# EAGLE schematic Easy_RFPA_RevC (EAGLE 6.6.0)
AUTHOR: MDT; BOMREV: 01; FABREV: B
Assembly variants: IRF520N_20W, IRF630_200W

## Sheet 1 of 6: Push-pull power stage
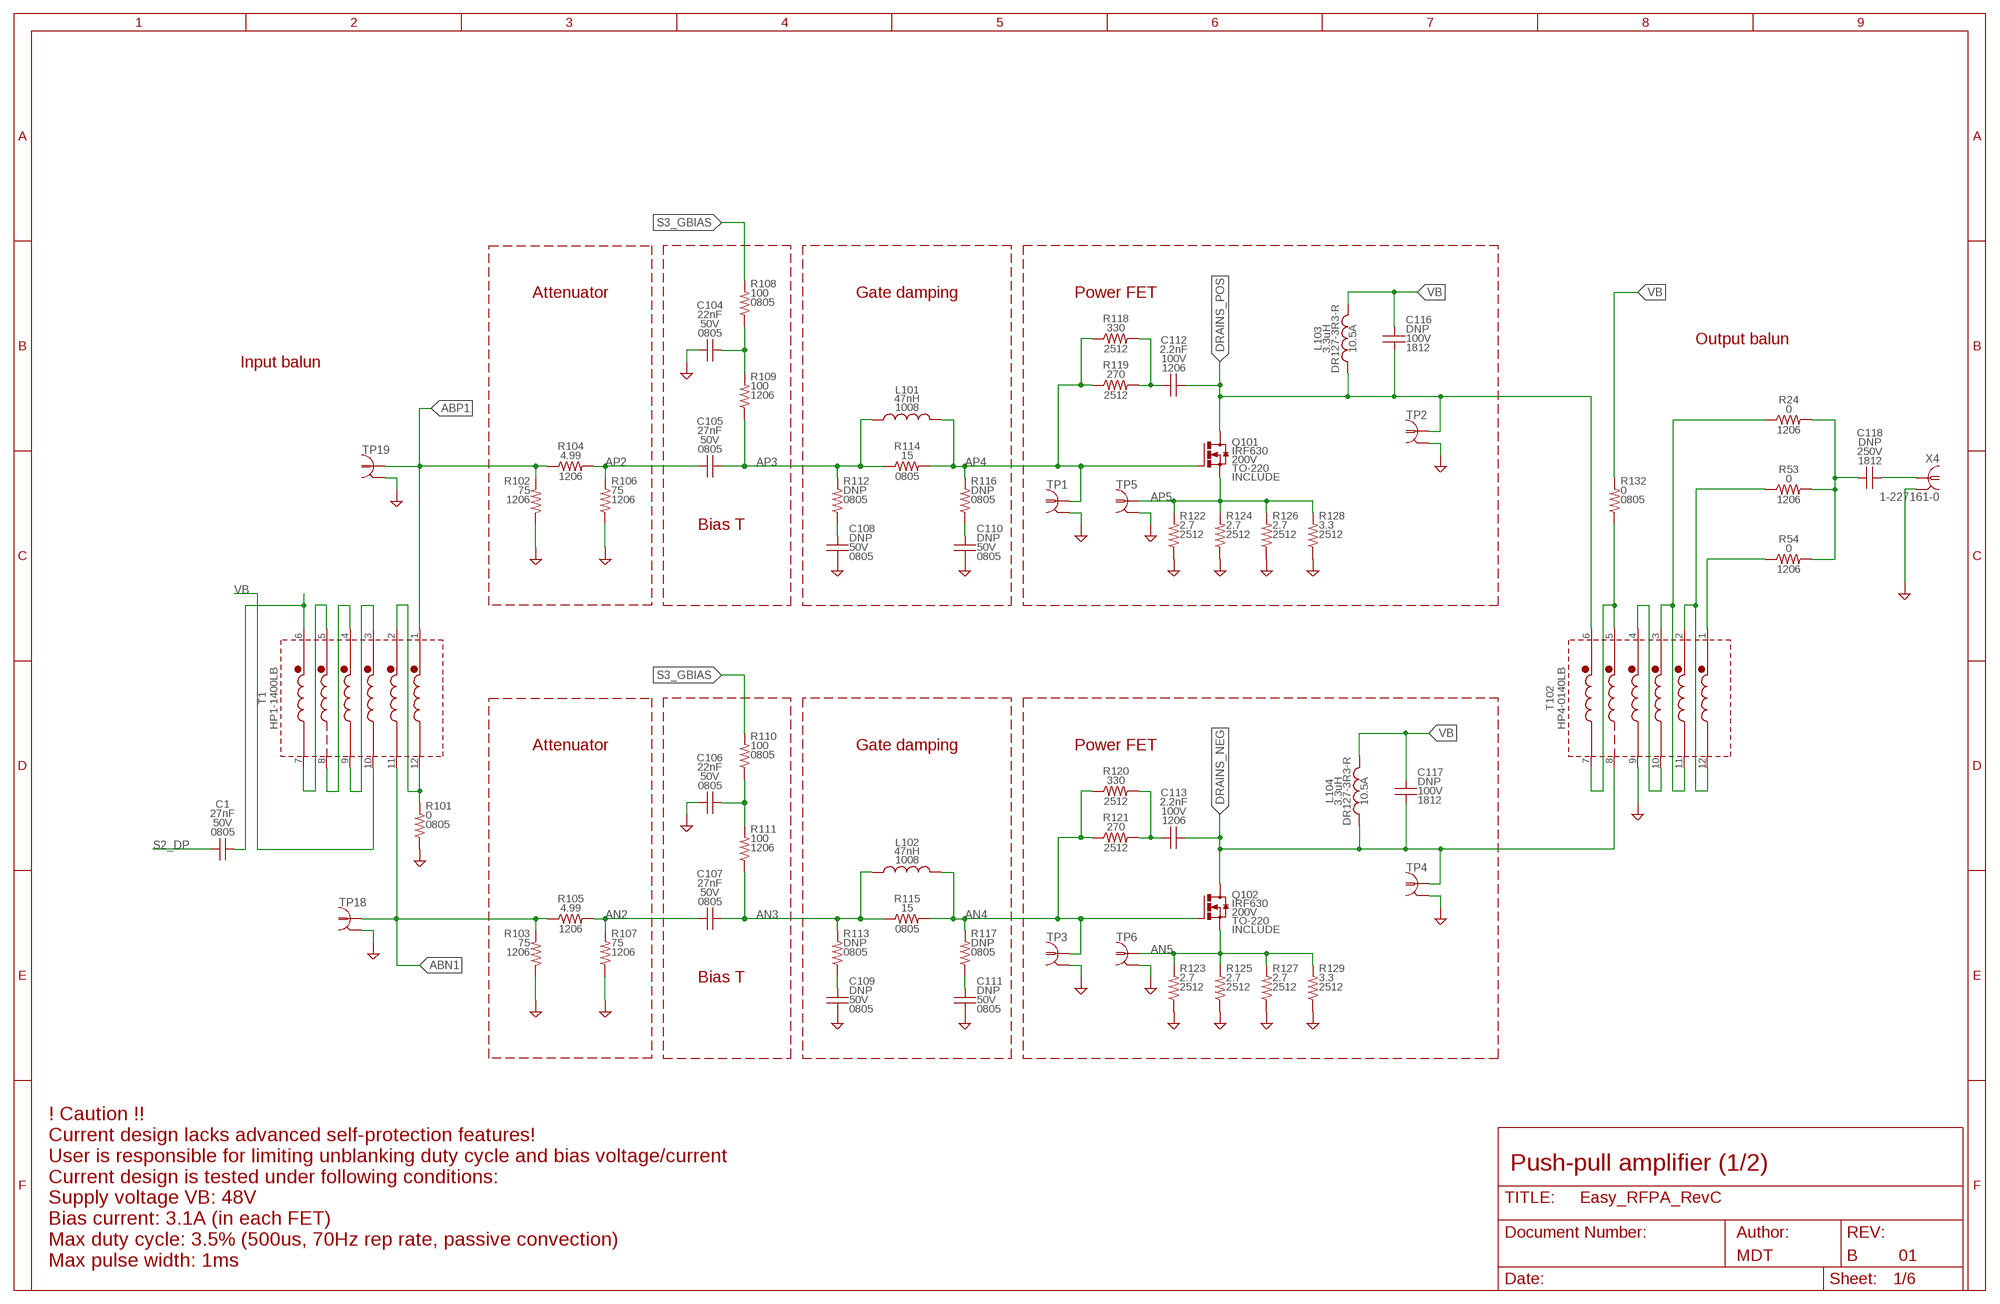
[diagram p0: schematic, sheet 1]

### Parts
C1  27nF  CGEN0805_IPC  [0805_IPC-7351B]
C104  22nF  CGEN0805_IPC  [0805_IPC-7351B]
C105  27nF  CGEN0805_IPC  [0805_IPC-7351B]
C106  22nF  CGEN0805_IPC  [0805_IPC-7351B]
C107  27nF  CGEN0805_IPC  [0805_IPC-7351B]
C108  DNP  CGEN0805_IPC  [0805_IPC-7351B]  (not fitted in variant IRF520N_20W)  (not fitted in variant IRF630_200W)
C109  DNP  CGEN0805_IPC  [0805_IPC-7351B]  (not fitted in variant IRF520N_20W)  (not fitted in variant IRF630_200W)
C110  DNP  CGEN0805_IPC  [0805_IPC-7351B]  (not fitted in variant IRF520N_20W)  (not fitted in variant IRF630_200W)
C111  DNP  CGEN0805_IPC  [0805_IPC-7351B]  (not fitted in variant IRF520N_20W)  (not fitted in variant IRF630_200W)
C112  2.2nF  CGENC1206  [C1206]
C113  2.2nF  CGENC1206  [C1206]
C116  DNP  CGENC1812  [C1812]
C117  DNP  CGENC1812  [C1812]
C118  DNP  CGENC1812  [C1812]  (not fitted in variant IRF630_200W)
L101  47nH  L_CHIPL-47N-AIR-5%-1008-1A1008  [L1008]
L102  47nH  L_CHIPL-47N-AIR-5%-1008-1A1008  [L1008]
L103  3.3uH  LL-3.3U-FERRITE-20%-12.5X12.5MM-10.5A  [DR127]  (variant IRF520N_20W: 22uH)
L104  3.3uH  LL-3.3U-FERRITE-20%-12.5X12.5MM-10.5A  [DR127]  (variant IRF520N_20W: 22uH)
Q101  IRF520N  MOSFET_NIRF630TO-220-VERT  [TO220BV]
Q102  IRF630  MOSFET_NIRF630TO-220-VERT  [TO220BV]
R24  0  R90GEN1206_IPC  [1206_IPC-7351B]
R53  0  R90GEN1206_IPC  [1206_IPC-7351B]
R54  0  R90GEN1206_IPC  [1206_IPC-7351B]
R101  0  RGEN0805_IPC  [0805_IPC-7351B]
R102  75  RGEN1206_IPC  [1206_IPC-7351B]
R103  75  RGEN1206_IPC  [1206_IPC-7351B]
R104  4.99  R90GEN1206_IPC  [1206_IPC-7351B]
R105  4.99  R90GEN1206_IPC  [1206_IPC-7351B]
R106  75  RGEN1206_IPC  [1206_IPC-7351B]
R107  75  RGEN1206_IPC  [1206_IPC-7351B]
R108  100  RGEN0805_IPC  [0805_IPC-7351B]
R109  100  RGEN1206_IPC  [1206_IPC-7351B]
R110  100  RGEN0805_IPC  [0805_IPC-7351B]
R111  100  RGEN1206_IPC  [1206_IPC-7351B]
R112  DNP  RGEN0805_IPC  [0805_IPC-7351B]  (not fitted in variant IRF520N_20W)  (not fitted in variant IRF630_200W)
R113  DNP  RGEN0805_IPC  [0805_IPC-7351B]  (not fitted in variant IRF520N_20W)  (not fitted in variant IRF630_200W)
R114  15  R90GEN0805_IPC  [0805_IPC-7351B]
R115  15  R90GEN0805_IPC  [0805_IPC-7351B]
R116  DNP  RGEN0805_IPC  [0805_IPC-7351B]  (not fitted in variant IRF520N_20W)  (not fitted in variant IRF630_200W)
R117  DNP  RGEN0805_IPC  [0805_IPC-7351B]  (not fitted in variant IRF520N_20W)  (not fitted in variant IRF630_200W)
R118  330  R90GENR2512  [R2512]
R119  270  R90GENR2512  [R2512]
R120  330  R90GENR2512  [R2512]
R121  270  R90GENR2512  [R2512]
R122  2.7  RGENR2512  [R2512]
R123  2.7  RGENR2512  [R2512]
R124  2.7  RGENR2512  [R2512]
R125  2.7  RGENR2512  [R2512]
R126  2.7  RGENR2512  [R2512]
R127  2.7  RGENR2512  [R2512]
R128  3.3  RGENR2512  [R2512]
R129  3.3  RGENR2512  [R2512]
R132  0  RGEN0805_IPC  [0805_IPC-7351B]
T1  HP1_TRAFO  [HP1]
T102  HP4_TRAFO  [HP4]
TP1  PROBE_TPTP_5MM  [PROBE_TP_5MM]
TP2  PROBE_TPTP_7P5MM  [PROBE_TP_7P5MM]
TP3  PROBE_TPTP_5MM  [PROBE_TP_5MM]
TP4  PROBE_TPTP_7P5MM  [PROBE_TP_7P5MM]
TP5  PROBE_TPTP_7P5MM  [PROBE_TP_7P5MM]
TP6  PROBE_TPTP_7P5MM  [PROBE_TP_7P5MM]
TP18  PROBE_TPTP_5MM  [PROBE_TP_5MM]
TP19  PROBE_TPTP_5MM  [PROBE_TP_5MM]
X4  1-227161-0  [AMP_227161]

### Nets
ABN1: R103.1 R105.1 T1.11(F2) TP18.TP ; also sheet 2
ABP1: R102.1 R104.1 T1.1(S1) TP19.TP ; also sheet 2
AN2: C107.2 R105.2 R107.1
AN3: C107.1 L102.1 R111.2 R113.1 R115.1
AN4: L102.2 Q102.G R115.2 R117.1 R120.1 R121.1 TP3.TP
AN5: Q102.S R123.1 R125.1 R127.1 R129.1 TP6.TP ; also sheet 3
AP2: C105.2 R104.2 R106.1
AP3: C105.1 L101.1 R109.2 R112.1 R114.1
AP4: L101.2 Q101.G R114.2 R116.1 R118.1 R119.1 TP1.TP
AP5: Q101.S R122.1 R124.1 R126.1 R128.1 TP5.TP ; also sheet 3
DRAINS_NEG [32W_20S]: C113.2 C117.2 L104.1 Q102.D T102.8(F5) TP4.TP ; also sheet 2
DRAINS_POS [32W_30S]: C112.2 C116.2 L103.1 Q101.D T102.6(S6) TP2.TP ; also sheet 2
GND: C104.2 C106.2 C108.2 C109.2 C110.2 C111.2 R101.2 R102.2 R103.2 R106.2 R107.2 R122.2 R123.2 R124.2 R125.2 R126.2 R127.2 R128.2 R129.2 T102.9(F4) TP1.GND(GND1) TP2.GND(GND1) TP3.GND(GND1) TP4.GND(GND1) TP5.GND(GND1) TP6.GND(GND1) TP18.GND(GND1) TP19.GND(GND1) X4.2 ; also sheet 2,3,4,5,6
N$4: C113.1 R120.2 R121.2
N$5: C109.1 R113.2
N$8: C104.1 R108.2 R109.1
N$10: C108.1 R112.2
N$11: C110.1 R116.2
N$12: C112.1 R118.2 R119.2
N$13: C106.1 R110.2 R111.1
N$17: C111.1 R117.2
N$29 [32W_30S]: R53.1 T102.2(S2) T102.12(F1)
N$30 [32W_30S]: R54.1 T102.1(S1)
N$31 [32W_30S]: C118.2 X4.1
N$49: C1.1 T1.6(S6)
N$52 [32W_30S]: R24.1 T102.3(S3) T102.11(F2)
N$58 [32W_30S]: T102.4(S4) T102.10(F3)
N$85: C118.1 R24.2 R53.2 R54.2
S2_DP: C1.2 ; also sheet 5
S3_GBIAS: R108.1 R110.1 ; also sheet 2,3
T1_CT: R101.1 T1.2(S2) T1.12(F1)
T1_P1: T1.5(S5) T1.7(F6)
T1_P2: T1.4(S4) T1.8(F5)
T1_P3: T1.3(S3) T1.9(F4)
VB: C116.1 C117.1 L103.2 L104.2 R132.1 T1.10(F3) ; also sheet 4,5
VB_CT: R132.2 T102.5(S5) T102.7(F6)

### Notes on the sheet
- Attenuator | Gate damping | Power FET
- Output balun
- Input balun
- Bias T
- Attenuator | Gate damping | Power FET
- Bias T
- Push-pull amplifier (1/2)
- ! Caution !!
  Current design lacks advanced self-protection features!
  User is responsible for limiting unblanking duty cycle and bias voltage/current
  Current design is tested under following conditions:
  Supply voltage VB: 48V
  Bias current: 3.1A (in each FET)
  Max duty cycle: 3.5% (500us, 70Hz rep rate, passive convection)
  Max pulse width: 1ms

## Sheet 2 of 6: Parallel copy of push-pull power stage
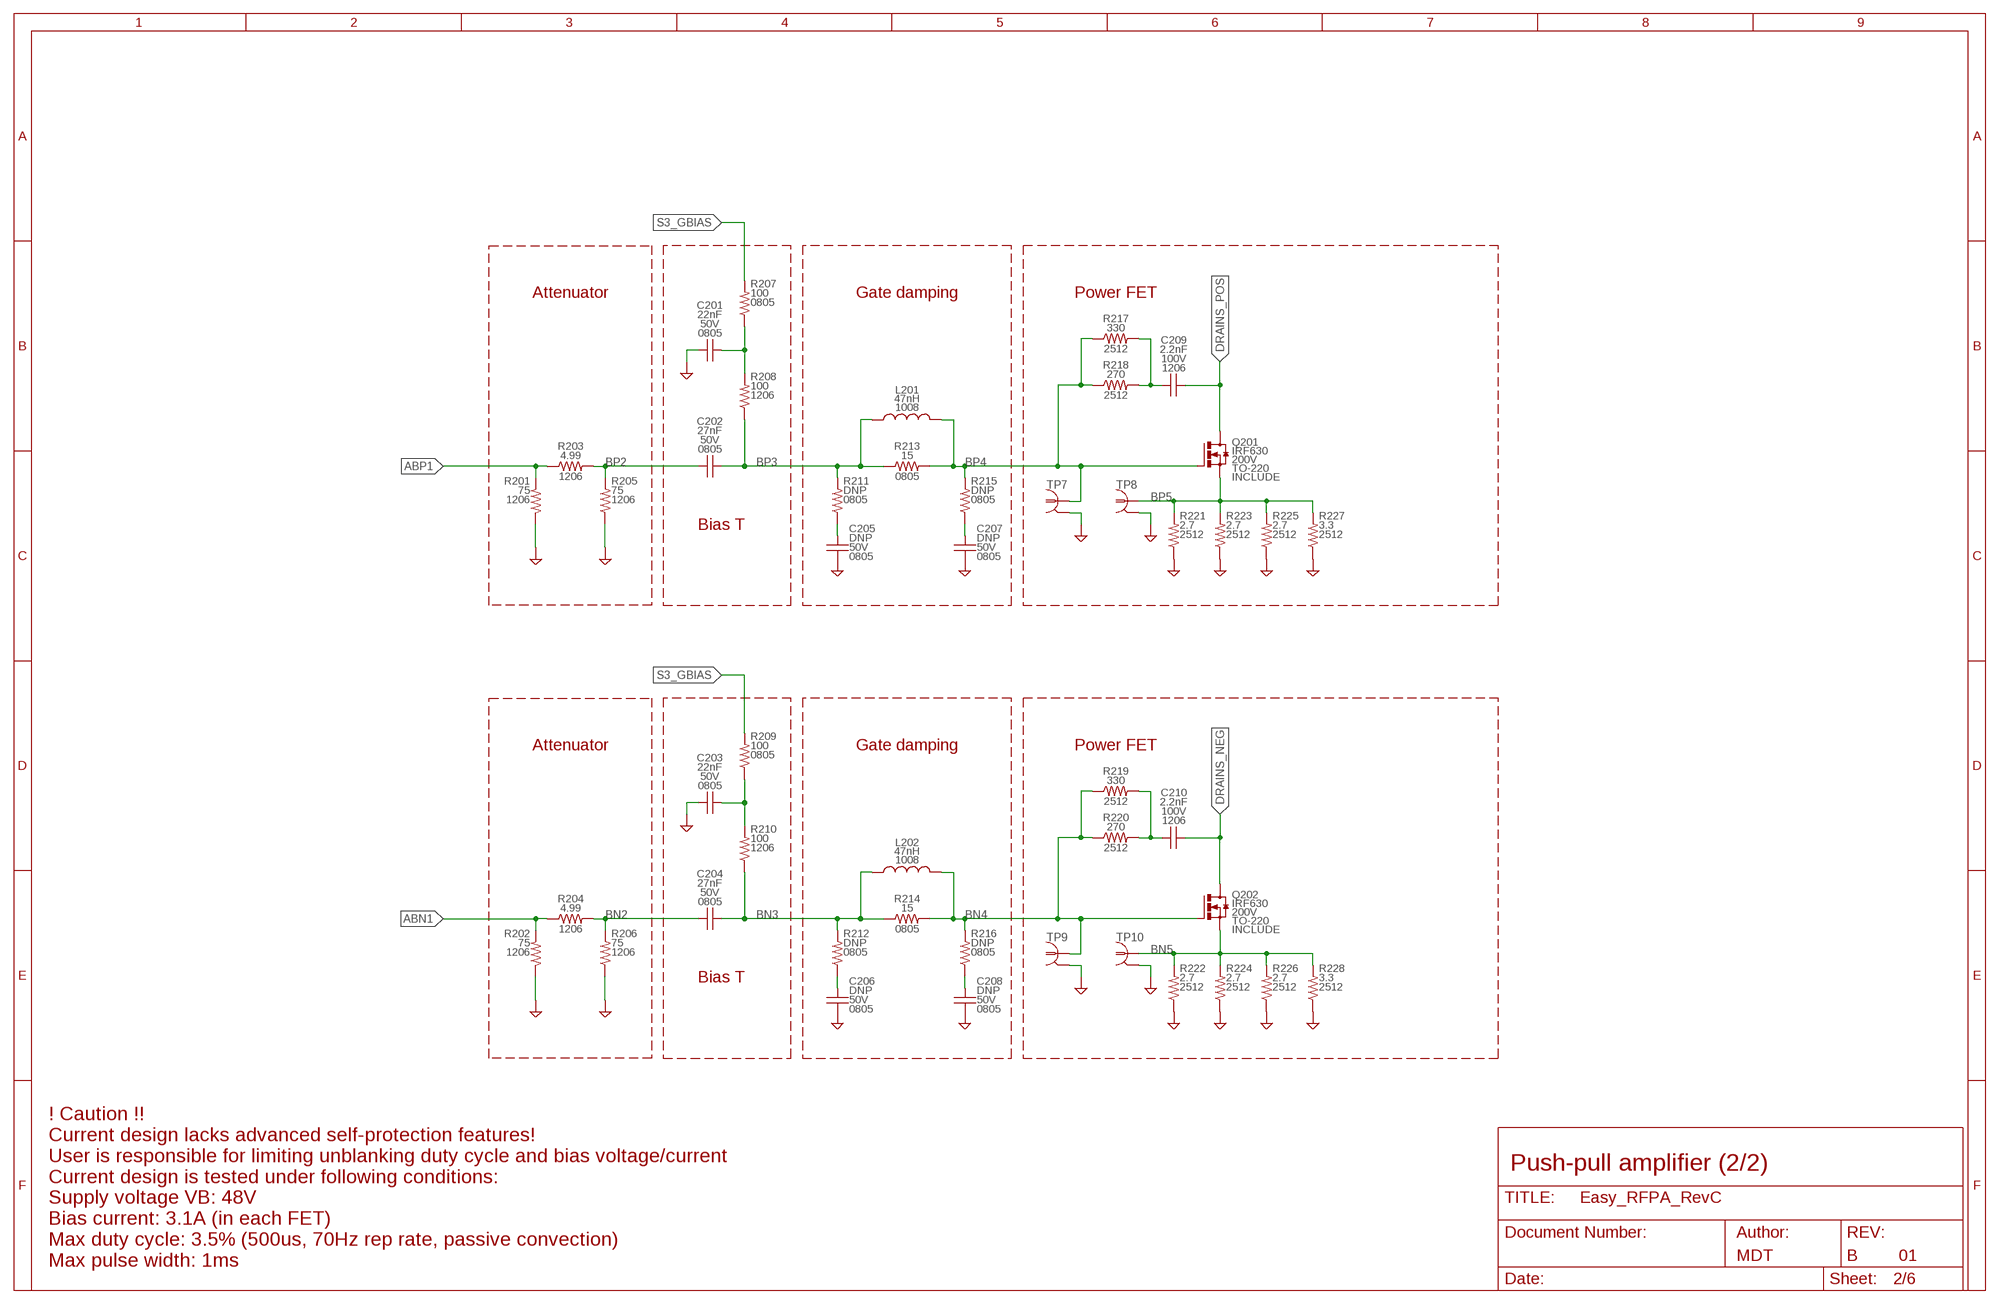
[diagram p1: schematic, sheet 2]

### Parts
C201  22nF  CGEN0805_IPC  [0805_IPC-7351B]  (not fitted in variant IRF520N_20W)
C202  27nF  CGEN0805_IPC  [0805_IPC-7351B]  (not fitted in variant IRF520N_20W)
C203  22nF  CGEN0805_IPC  [0805_IPC-7351B]  (not fitted in variant IRF520N_20W)
C204  27nF  CGEN0805_IPC  [0805_IPC-7351B]  (not fitted in variant IRF520N_20W)
C205  DNP  CGEN0805_IPC  [0805_IPC-7351B]  (not fitted in variant IRF520N_20W)  (not fitted in variant IRF630_200W)
C206  DNP  CGEN0805_IPC  [0805_IPC-7351B]  (not fitted in variant IRF520N_20W)  (not fitted in variant IRF630_200W)
C207  DNP  CGEN0805_IPC  [0805_IPC-7351B]  (not fitted in variant IRF520N_20W)  (not fitted in variant IRF630_200W)
C208  DNP  CGEN0805_IPC  [0805_IPC-7351B]  (not fitted in variant IRF520N_20W)  (not fitted in variant IRF630_200W)
C209  2.2nF  CGENC1206  [C1206]  (not fitted in variant IRF520N_20W)
C210  2.2nF  CGENC1206  [C1206]  (not fitted in variant IRF520N_20W)
L201  47nH  L_CHIPL-47N-AIR-5%-1008-1A1008  [L1008]  (not fitted in variant IRF520N_20W)
L202  47nH  L_CHIPL-47N-AIR-5%-1008-1A1008  [L1008]  (not fitted in variant IRF520N_20W)
Q201  IRF630  MOSFET_NIRF630TO-220-VERT  [TO220BV]  (not fitted in variant IRF520N_20W)
Q202  IRF630  MOSFET_NIRF630TO-220-VERT  [TO220BV]  (not fitted in variant IRF520N_20W)
R201  75  RGEN1206_IPC  [1206_IPC-7351B]  (not fitted in variant IRF520N_20W)
R202  75  RGEN1206_IPC  [1206_IPC-7351B]  (not fitted in variant IRF520N_20W)
R203  4.99  R90GEN1206_IPC  [1206_IPC-7351B]  (not fitted in variant IRF520N_20W)
R204  4.99  R90GEN1206_IPC  [1206_IPC-7351B]  (not fitted in variant IRF520N_20W)
R205  75  RGEN1206_IPC  [1206_IPC-7351B]  (not fitted in variant IRF520N_20W)
R206  75  RGEN1206_IPC  [1206_IPC-7351B]  (not fitted in variant IRF520N_20W)
R207  100  RGEN0805_IPC  [0805_IPC-7351B]  (not fitted in variant IRF520N_20W)
R208  100  RGEN1206_IPC  [1206_IPC-7351B]  (not fitted in variant IRF520N_20W)
R209  100  RGEN0805_IPC  [0805_IPC-7351B]  (not fitted in variant IRF520N_20W)
R210  100  RGEN1206_IPC  [1206_IPC-7351B]  (not fitted in variant IRF520N_20W)
R211  DNP  RGEN0805_IPC  [0805_IPC-7351B]  (not fitted in variant IRF520N_20W)  (not fitted in variant IRF630_200W)
R212  DNP  RGEN0805_IPC  [0805_IPC-7351B]  (not fitted in variant IRF520N_20W)  (not fitted in variant IRF630_200W)
R213  15  R90GEN0805_IPC  [0805_IPC-7351B]  (not fitted in variant IRF520N_20W)
R214  15  R90GEN0805_IPC  [0805_IPC-7351B]  (not fitted in variant IRF520N_20W)
R215  DNP  RGEN0805_IPC  [0805_IPC-7351B]  (not fitted in variant IRF520N_20W)  (not fitted in variant IRF630_200W)
R216  DNP  RGEN0805_IPC  [0805_IPC-7351B]  (not fitted in variant IRF520N_20W)  (not fitted in variant IRF630_200W)
R217  330  R90GENR2512  [R2512]  (not fitted in variant IRF520N_20W)
R218  270  R90GENR2512  [R2512]  (not fitted in variant IRF520N_20W)
R219  330  R90GENR2512  [R2512]  (not fitted in variant IRF520N_20W)
R220  270  R90GENR2512  [R2512]  (not fitted in variant IRF520N_20W)
R221  2.7  RGENR2512  [R2512]  (not fitted in variant IRF520N_20W)
R222  2.7  RGENR2512  [R2512]  (not fitted in variant IRF520N_20W)
R223  2.7  RGENR2512  [R2512]  (not fitted in variant IRF520N_20W)
R224  2.7  RGENR2512  [R2512]  (not fitted in variant IRF520N_20W)
R225  2.7  RGENR2512  [R2512]  (not fitted in variant IRF520N_20W)
R226  2.7  RGENR2512  [R2512]  (not fitted in variant IRF520N_20W)
R227  3.3  RGENR2512  [R2512]  (not fitted in variant IRF520N_20W)
R228  3.3  RGENR2512  [R2512]  (not fitted in variant IRF520N_20W)
TP7  PROBE_TPTP_5MM  [PROBE_TP_5MM]
TP8  PROBE_TPTP_7P5MM  [PROBE_TP_7P5MM]
TP9  PROBE_TPTP_5MM  [PROBE_TP_5MM]
TP10  PROBE_TPTP_7P5MM  [PROBE_TP_7P5MM]

### Nets
ABN1: R202.1 R204.1 ; also sheet 1
ABP1: R201.1 R203.1 ; also sheet 1
BN2: C204.2 R204.2 R206.1
BN3: C204.1 L202.1 R210.2 R212.1 R214.1
BN4: L202.2 Q202.G R214.2 R216.1 R219.1 R220.1 TP9.TP
BN5: Q202.S R222.1 R224.1 R226.1 R228.1 TP10.TP ; also sheet 3
BP2: C202.2 R203.2 R205.1
BP3: C202.1 L201.1 R208.2 R211.1 R213.1
BP4: L201.2 Q201.G R213.2 R215.1 R217.1 R218.1 TP7.TP
BP5: Q201.S R221.1 R223.1 R225.1 R227.1 TP8.TP ; also sheet 3
DRAINS_NEG [32W_20S]: C210.2 Q202.D ; also sheet 1
DRAINS_POS [32W_30S]: C209.2 Q201.D ; also sheet 1
GND: C201.2 C203.2 C205.2 C206.2 C207.2 C208.2 R201.2 R202.2 R205.2 R206.2 R221.2 R222.2 R223.2 R224.2 R225.2 R226.2 R227.2 R228.2 TP7.GND(GND1) TP8.GND(GND1) TP9.GND(GND1) TP10.GND(GND1) ; also sheet 1,3,4,5,6
N$35: C203.1 R209.2 R210.1
N$36: C206.1 R212.2
N$38: C208.1 R216.2
N$39: C210.1 R219.2 R220.2
N$40: C201.1 R207.2 R208.1
N$42: C205.1 R211.2
N$48: C207.1 R215.2
N$50: C209.1 R217.2 R218.2
S3_GBIAS: R207.1 R209.1 ; also sheet 1,3

### Notes on the sheet
- Attenuator | Gate damping | Power FET
- Bias T
- Attenuator | Gate damping | Power FET
- Bias T
- Push-pull amplifier (2/2)
- ! Caution !!
  Current design lacks advanced self-protection features!
  User is responsible for limiting unblanking duty cycle and bias voltage/current
  Current design is tested under following conditions:
  Supply voltage VB: 48V
  Bias current: 3.1A (in each FET)
  Max duty cycle: 3.5% (500us, 70Hz rep rate, passive convection)
  Max pulse width: 1ms

## Sheet 3 of 6: Gate bias driver
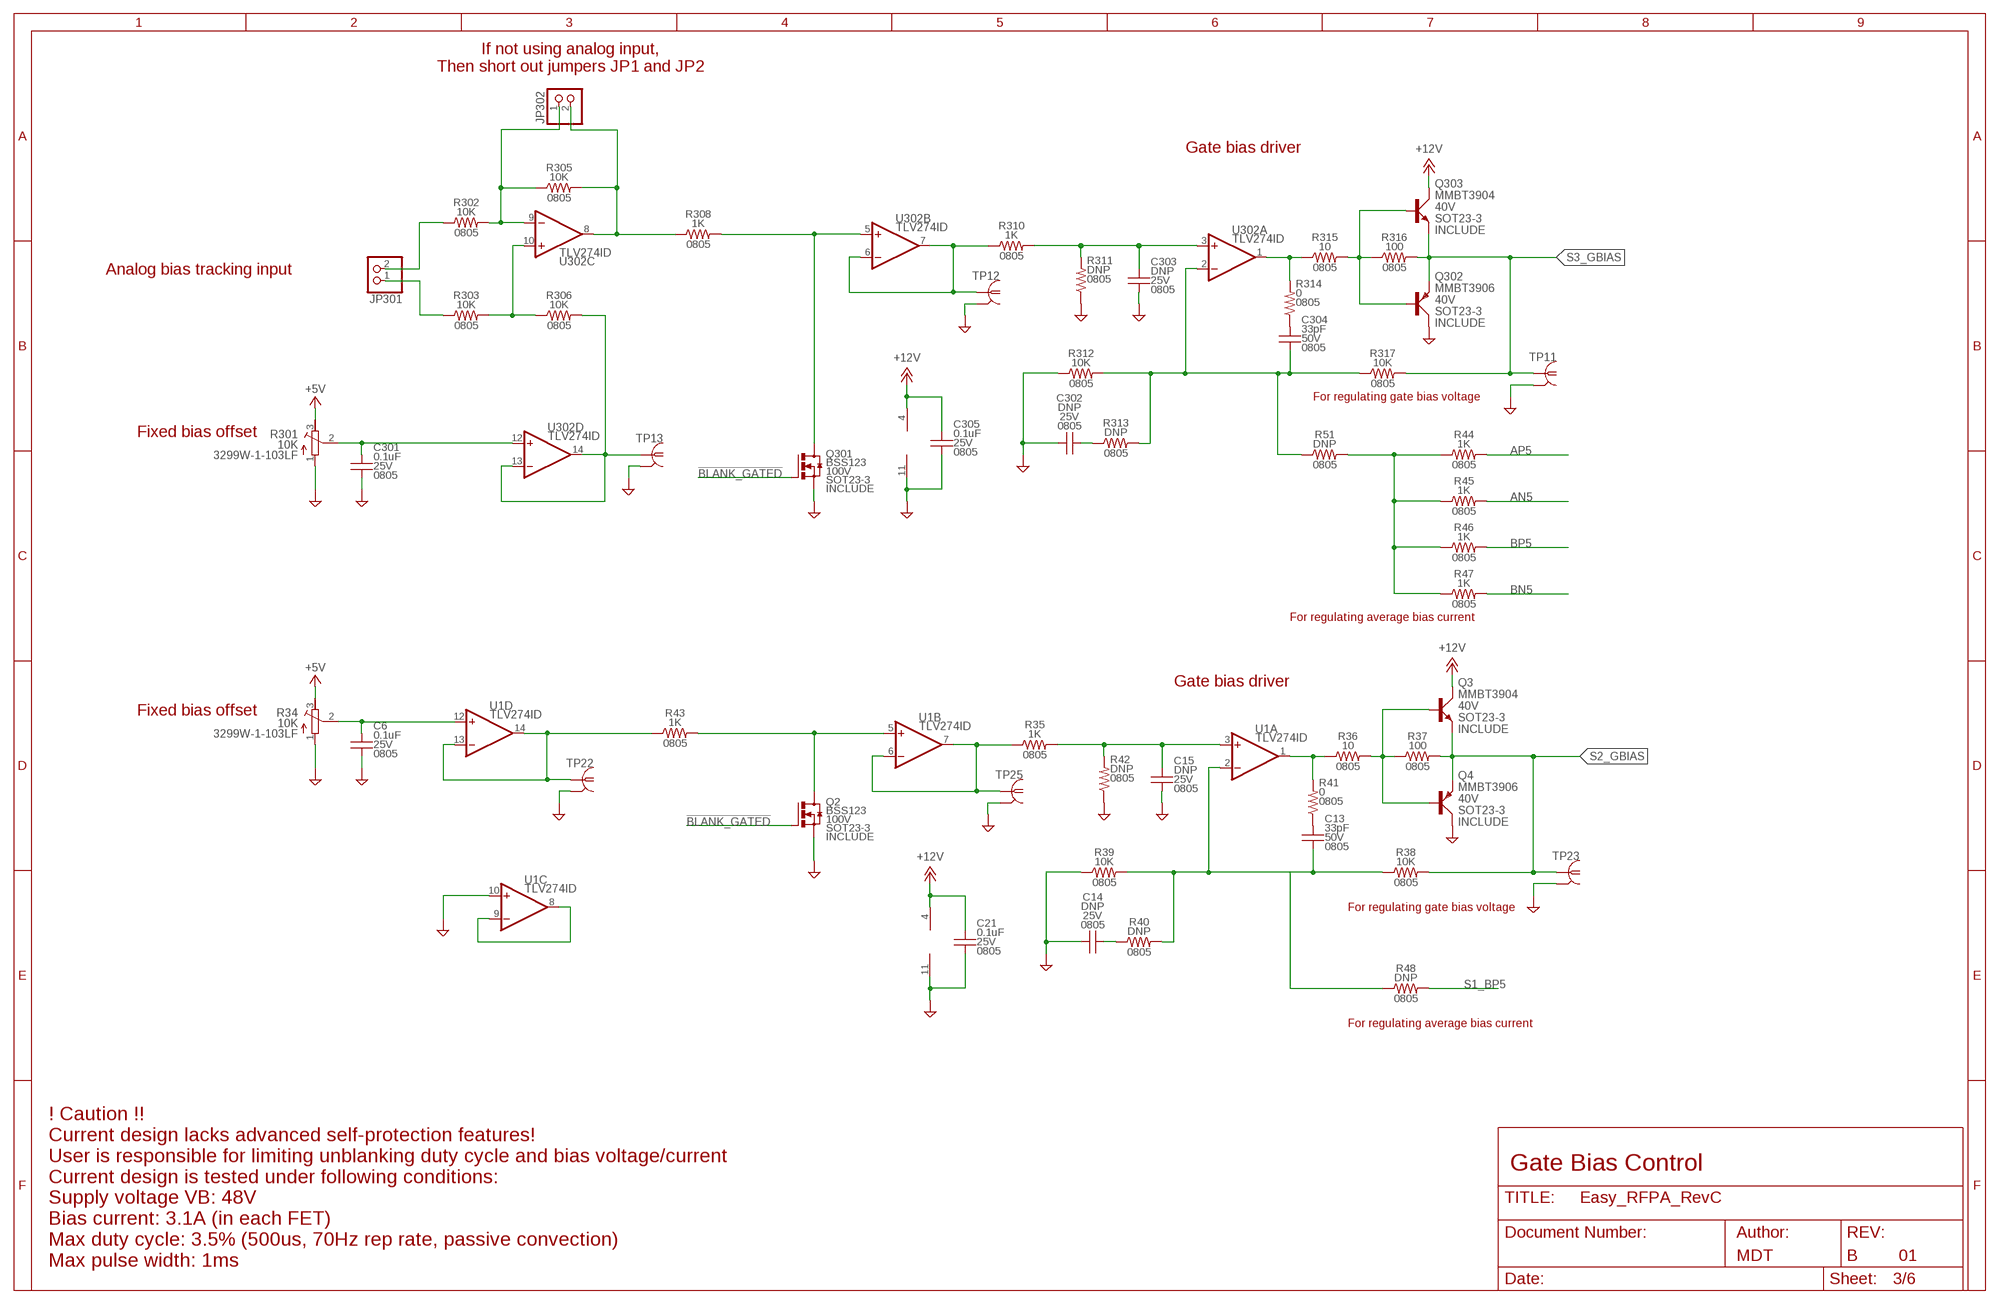
[diagram p2: schematic, sheet 3]

### Parts
C6  0.1uF  CGEN0805_IPC  [0805_IPC-7351B]
C13  33pF  CGEN0805_IPC  [0805_IPC-7351B]
C14  DNP  CGEN0805_IPC  [0805_IPC-7351B]  (not fitted in variant IRF520N_20W)  (not fitted in variant IRF630_200W)
C15  DNP  CGEN0805_IPC  [0805_IPC-7351B]  (not fitted in variant IRF520N_20W)  (not fitted in variant IRF630_200W)
C21  0.1uF  CGEN0805_IPC  [0805_IPC-7351B]
C301  0.1uF  CGEN0805_IPC  [0805_IPC-7351B]
C302  DNP  CGEN0805_IPC  [0805_IPC-7351B]  (not fitted in variant IRF520N_20W)  (not fitted in variant IRF630_200W)
C303  DNP  CGEN0805_IPC  [0805_IPC-7351B]  (not fitted in variant IRF520N_20W)  (not fitted in variant IRF630_200W)
C304  33pF  CGEN0805_IPC  [0805_IPC-7351B]
C305  0.1uF  CGEN0805_IPC  [0805_IPC-7351B]
JP301  PINHD-1X2  [1X02]
JP302  PINHD-1X2  [1X02]
Q2  MOSFET_NBSS123SOT23  [SOT23R_INFINEON]
Q3  NPNMMBT3904SOT23_BEC  [SOT23R_INFINEON]
Q4  PNPSOT23_BEC  [SOT23R_INFINEON]
Q301  MOSFET_NBSS123SOT23  [SOT23R_INFINEON]
Q302  PNPSOT23_BEC  [SOT23R_INFINEON]
Q303  NPNMMBT3904SOT23_BEC  [SOT23R_INFINEON]
R34  10K  RTRIMRTRIM-10K-10%-3299W-0.5W3299W  [RTRIM3299W]
R35  1K  R90GEN0805_IPC  [0805_IPC-7351B]
R36  10  R90GEN0805_IPC  [0805_IPC-7351B]
R37  100  R90GEN0805_IPC  [0805_IPC-7351B]
R38  10K  R90GEN0805_IPC  [0805_IPC-7351B]
R39  10K  R90GEN0805_IPC  [0805_IPC-7351B]
R40  DNP  R90GEN0805_IPC  [0805_IPC-7351B]  (not fitted in variant IRF520N_20W)  (not fitted in variant IRF630_200W)
R41  0  RGEN0805_IPC  [0805_IPC-7351B]
R42  DNP  RGEN0805_IPC  [0805_IPC-7351B]  (not fitted in variant IRF520N_20W)  (not fitted in variant IRF630_200W)
R43  1K  R90GEN0805_IPC  [0805_IPC-7351B]
R44  1K  R90GEN0805_IPC  [0805_IPC-7351B]
R45  1K  R90GEN0805_IPC  [0805_IPC-7351B]
R46  1K  R90GEN0805_IPC  [0805_IPC-7351B]
R47  1K  R90GEN0805_IPC  [0805_IPC-7351B]
R48  DNP  R90GEN0805_IPC  [0805_IPC-7351B]
R51  DNP  R90GEN0805_IPC  [0805_IPC-7351B]
R301  10K  RTRIMRTRIM-10K-10%-3299W-0.5W3299W  [RTRIM3299W]
R302  10K  R90GEN0805_IPC  [0805_IPC-7351B]
R303  10K  R90GEN0805_IPC  [0805_IPC-7351B]
R305  10K  R90GEN0805_IPC  [0805_IPC-7351B]
R306  10K  R90GEN0805_IPC  [0805_IPC-7351B]
R308  1K  R90GEN0805_IPC  [0805_IPC-7351B]
R310  1K  R90GEN0805_IPC  [0805_IPC-7351B]
R311  DNP  RGEN0805_IPC  [0805_IPC-7351B]  (not fitted in variant IRF520N_20W)  (not fitted in variant IRF630_200W)
R312  10K  R90GEN0805_IPC  [0805_IPC-7351B]
R313  DNP  R90GEN0805_IPC  [0805_IPC-7351B]  (not fitted in variant IRF520N_20W)  (not fitted in variant IRF630_200W)
R314  0  RGEN0805_IPC  [0805_IPC-7351B]
R315  10  R90GEN0805_IPC  [0805_IPC-7351B]
R316  100  R90GEN0805_IPC  [0805_IPC-7351B]
R317  10K  R90GEN0805_IPC  [0805_IPC-7351B]
TP11  PROBE_TPTP_5MM  [PROBE_TP_5MM]
TP12  PROBE_TPTP_5MM  [PROBE_TP_5MM]
TP13  PROBE_TPTP_5MM  [PROBE_TP_5MM]
TP22  PROBE_TPTP_5MM  [PROBE_TP_5MM]
TP23  PROBE_TPTP_5MM  [PROBE_TP_5MM]
TP25  PROBE_TPTP_5MM  [PROBE_TP_5MM]
U1  OPAMP_QUADTLV274IDSOIC14  [SO14]
U302  OPAMP_QUADTLV274IDSOIC14  [SO14]

### Nets
!BLANK_GATED: Q2.1(G) Q301.1(G) ; also sheet 6
+5V: R34.3(E) R301.3(E) ; also sheet 4,6
+12V: C21.1 C305.1 Q3.3(C) Q303.3(C) U1.4(P:V+) U302.4(P:V+) ; also sheet 4
AN5: R45.2 ; also sheet 1
AP5: R44.2 ; also sheet 1
BN5: R47.2 ; also sheet 2
BP5: R46.2 ; also sheet 2
GND: C6.2 C14.2 C15.2 C21.2 C301.2 C302.2 C303.2 C305.2 Q2.2(S) Q4.3(C) Q301.2(S) Q302.3(C) R34.1(A) R39.1 R42.2 R301.1(A) R311.2 R312.1 TP11.GND(GND1) TP12.GND(GND1) TP13.GND(GND1) TP22.GND(GND1) TP23.GND(GND1) TP25.GND(GND1) U1.10(C:+IN) U1.11(P:V-) U302.11(P:V-) ; also sheet 1,2,4,5,6
N$1: R314.1 R315.1 U302.1(A:OUT)
N$2: Q302.1(B) Q303.1(B) R315.2 R316.1
N$6: R310.1 TP12.TP U302.6(B:-IN) U302.7(B:OUT)
N$7: C304.1 R314.2
N$9: C302.1 R313.1
N$14: C304.2 R51.1 R312.2 R313.2 R317.1 U302.2(A:-IN)
N$15: C303.1 R310.2 R311.1 U302.3(A:+IN)
N$16: R303.2 R306.1 U302.10(C:+IN)
N$18: JP302.2 R305.2 R308.1 U302.8(C:OUT)
N$19: JP302.1 R302.2 R305.1 U302.9(C:-IN)
N$20: JP301.2 R302.1
N$21: JP301.1 R303.1
N$22: R44.1 R45.1 R46.1 R47.1 R51.2
N$23: Q301.3(D) R308.2 U302.5(B:+IN)
N$24: R43.1 TP22.TP U1.13(D:-IN) U1.14(D:OUT)
N$25: C301.1 R301.2(S) U302.12(D:+IN)
N$26: R306.2 TP13.TP U302.13(D:-IN) U302.14(D:OUT)
N$64: C6.1 R34.2(S) U1.12(D:+IN)
N$66: R36.1 R41.1 U1.1(A:OUT)
N$75: U1.8(C:OUT) U1.9(C:-IN)
N$79: Q3.1(B) Q4.1(B) R36.2 R37.1
N$82: C13.2 R38.1 R39.2 R40.2 R48.1 U1.2(A:-IN)
N$83: C15.1 R35.2 R42.1 U1.3(A:+IN)
N$84: C14.1 R40.1
N$86: R35.1 TP25.TP U1.6(B:-IN) U1.7(B:OUT)
N$87: C13.1 R41.2
N$88: Q2.3(D) R43.2 U1.5(B:+IN)
S1_BP5: R48.2 ; also sheet 5
S2_GBIAS: Q3.2(E) Q4.2(E) R37.2 R38.2 TP23.TP ; also sheet 5
S3_GBIAS: Q302.2(E) Q303.2(E) R316.2 R317.2 TP11.TP ; also sheet 1,2

### Notes on the sheet
- If not using analog input,
  Then short out jumpers JP1 and JP2
- Gate bias driver
- Analog bias tracking input
- For regulating gate bias voltage
- Fixed bias offset
- For regulating average bias current
- Gate bias driver
- Fixed bias offset
- For regulating gate bias voltage
- For regulating average bias current
- Gate Bias Control
- ! Caution !!
  Current design lacks advanced self-protection features!
  User is responsible for limiting unblanking duty cycle and bias voltage/current
  Current design is tested under following conditions:
  Supply voltage VB: 48V
  Bias current: 3.1A (in each FET)
  Max duty cycle: 3.5% (500us, 70Hz rep rate, passive convection)
  Max pulse width: 1ms

## Sheet 4 of 6: Power entry
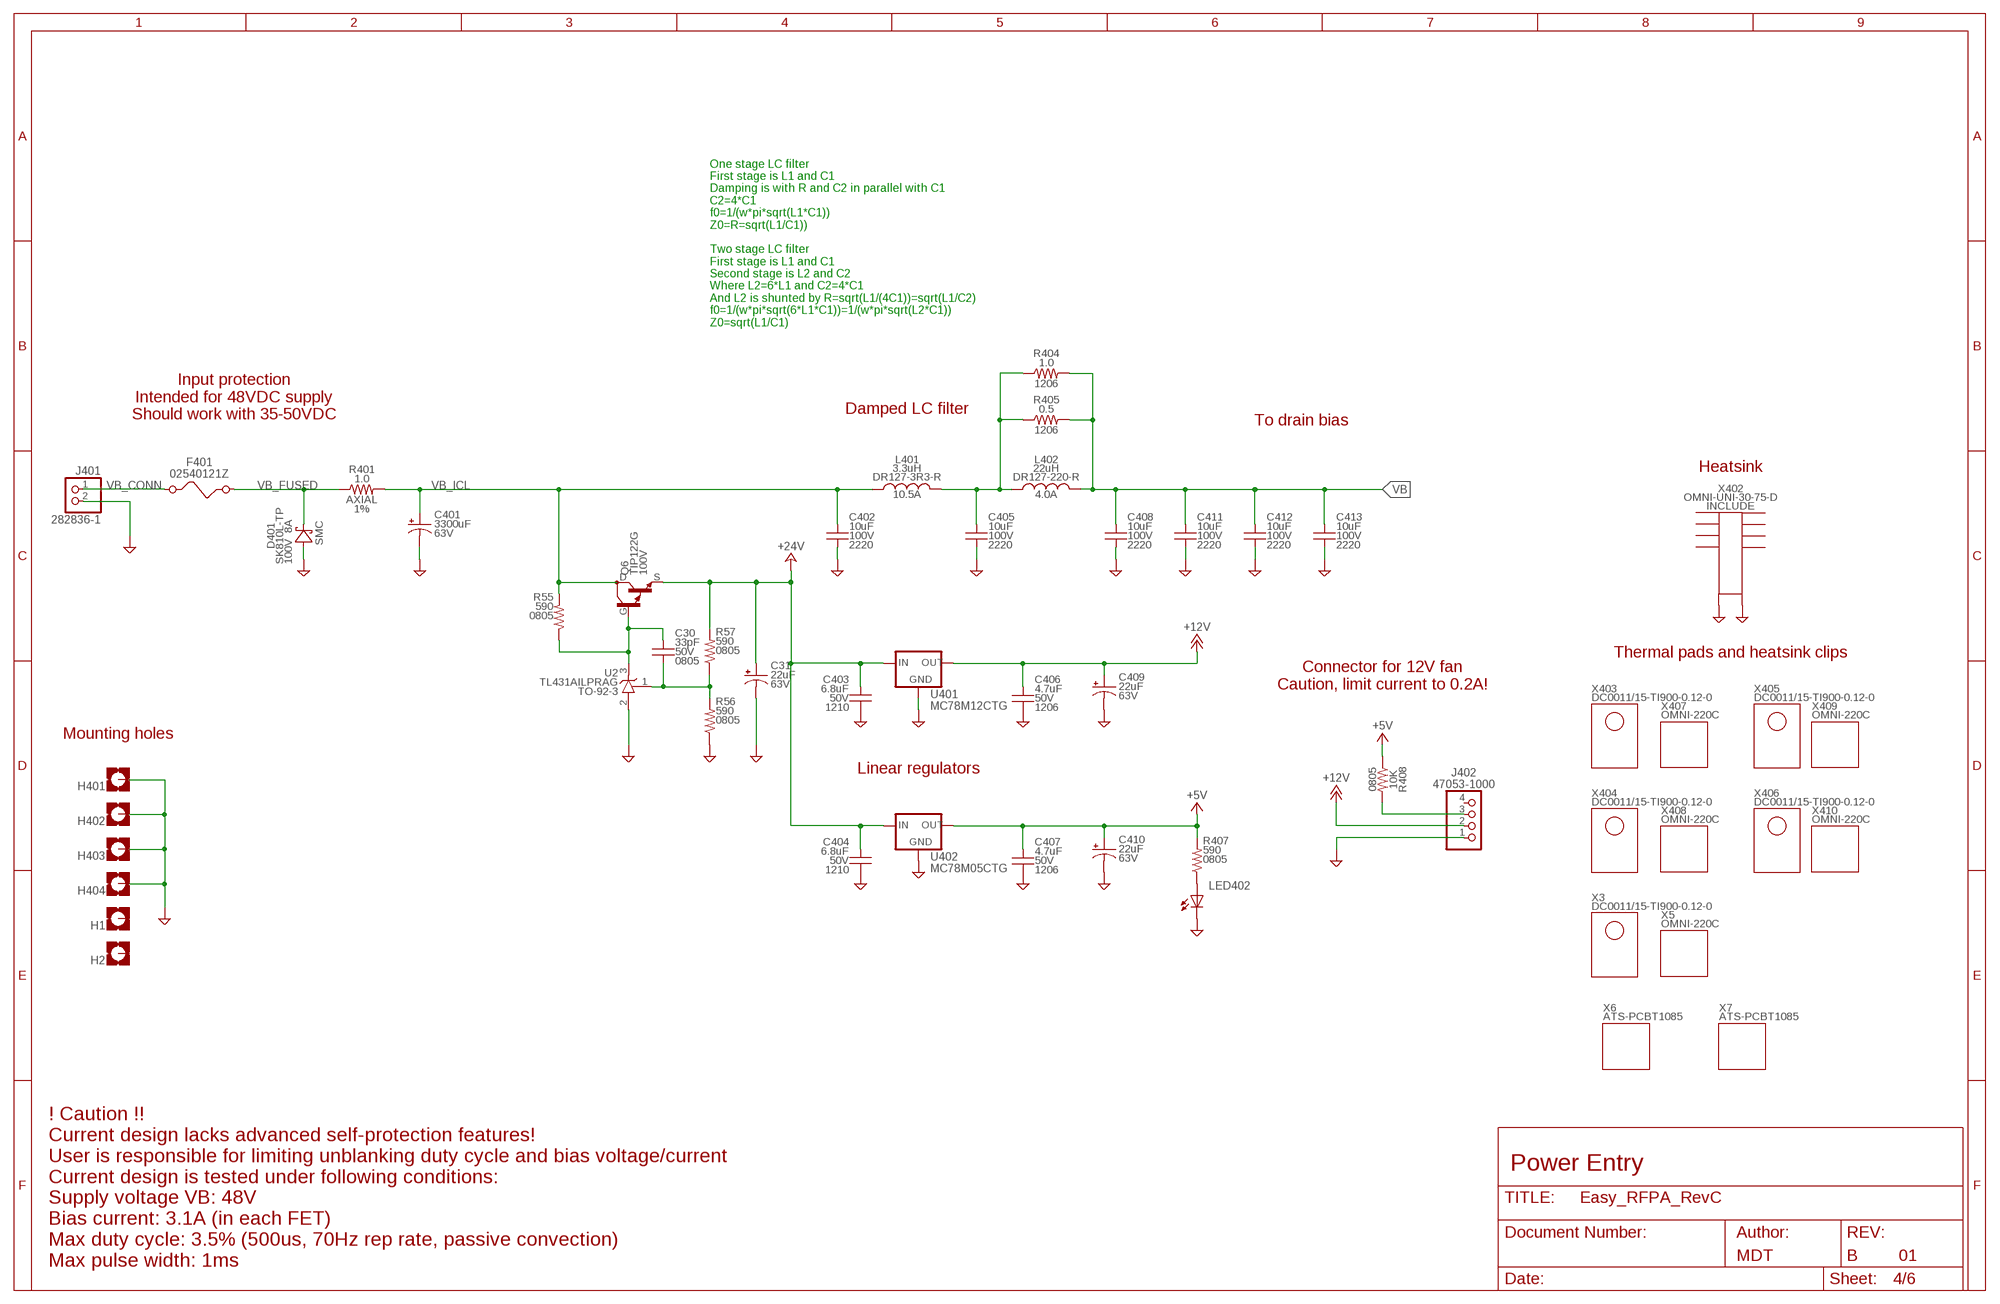
[diagram p3: schematic, sheet 4]
X3 (THERMALPAD_TO220DC0011/15-TI900-0.12-0): BOM: INCLUDE; DESCRIPTION: THERM PAD 21.84MMX18.79MM WHITE; MATERIAL: Ti900; PARTNO: DC0011/15-TI900-0.12-0; VENDOR: t-Global Technology
X5 (HEATSINK_CLIPOMNI-220C): BOM: INCLUDE; DESCRIPTION: UNIVERSAL TO-220 HEATSINK CLIP; PARTNO: OMNI-220C; VENDOR: Wakefield-Vette
X403 (THERMALPAD_TO220DC0011/15-TI900-0.12-0): BOM: INCLUDE; DESCRIPTION: THERM PAD 21.84MMX18.79MM WHITE; MATERIAL: Ti900; PARTNO: DC0011/15-TI900-0.12-0; VENDOR: t-Global Technology
X404 (THERMALPAD_TO220DC0011/15-TI900-0.12-0): BOM: INCLUDE; DESCRIPTION: THERM PAD 21.84MMX18.79MM WHITE; MATERIAL: Ti900; PARTNO: DC0011/15-TI900-0.12-0; VENDOR: t-Global Technology
X405 (THERMALPAD_TO220DC0011/15-TI900-0.12-0): BOM: INCLUDE; DESCRIPTION: THERM PAD 21.84MMX18.79MM WHITE; MATERIAL: Ti900; PARTNO: DC0011/15-TI900-0.12-0; VENDOR: t-Global Technology
X406 (THERMALPAD_TO220DC0011/15-TI900-0.12-0): BOM: INCLUDE; DESCRIPTION: THERM PAD 21.84MMX18.79MM WHITE; MATERIAL: Ti900; PARTNO: DC0011/15-TI900-0.12-0; VENDOR: t-Global Technology
X407 (HEATSINK_CLIPOMNI-220C): BOM: INCLUDE; DESCRIPTION: UNIVERSAL TO-220 HEATSINK CLIP; PARTNO: OMNI-220C; VENDOR: Wakefield-Vette
X408 (HEATSINK_CLIPOMNI-220C): BOM: INCLUDE; DESCRIPTION: UNIVERSAL TO-220 HEATSINK CLIP; PARTNO: OMNI-220C; VENDOR: Wakefield-Vette
X409 (HEATSINK_CLIPOMNI-220C): BOM: INCLUDE; DESCRIPTION: UNIVERSAL TO-220 HEATSINK CLIP; PARTNO: OMNI-220C; VENDOR: Wakefield-Vette
X410 (HEATSINK_CLIPOMNI-220C): BOM: INCLUDE; DESCRIPTION: UNIVERSAL TO-220 HEATSINK CLIP; PARTNO: OMNI-220C; VENDOR: Wakefield-Vette

### Parts
C30  33pF  CGEN0805_IPC  [0805_IPC-7351B]
C31  22uF  CPOLC-22U-63V-20%-6.3DX12.5L-ELECE2,5-7  [E2,5-7]
C401  3300uF  CPOLC-3300U-63V-20%-25DX37L-ELECEB25D  [EB25D]
C402  10uF  CCC-10U-100V-20%-2220-X7TC2220_CKG57N  [C2220_CKG57N]
C403  6.8uF  CGENC1210  [C1210]
C404  6.8uF  CGENC1210  [C1210]
C405  10uF  CCC-10U-100V-20%-2220-X7TC2220_CKG57N  [C2220_CKG57N]
C406  4.7uF  CGENC1206  [C1206]
C407  4.7uF  CGENC1206  [C1206]
C408  10uF  CCC-10U-100V-20%-2220-X7TC2220_CKG57N  [C2220_CKG57N]
C409  22uF  CPOLC-22U-63V-20%-6.3DX12.5L-ELECE2,5-7  [E2,5-7]
C410  22uF  CPOLC-22U-63V-20%-6.3DX12.5L-ELECE2,5-7  [E2,5-7]
C411  10uF  CCC-10U-100V-20%-2220-X7TC2220_CKG57N  [C2220_CKG57N]
C412  10uF  CCC-10U-100V-20%-2220-X7TC2220_CKG57N  [C2220_CKG57N]
C413  10uF  CCC-10U-100V-20%-2220-X7TC2220_CKG57N  [C2220_CKG57N]
D401  D-SCHOTTKYSK810L-TPSMC  [DO-214AB(SMC)]
F401  FUSE_2P  [02540121Z]
H1  MOUNT-PAD-SQUARE3.2  [3,2-PAD-SQUARE]
H2  MOUNT-PAD-SQUARE3.2  [3,2-PAD-SQUARE]
H401  MOUNT-PAD-SQUARE3.2  [3,2-PAD-SQUARE]
H402  MOUNT-PAD-SQUARE3.2  [3,2-PAD-SQUARE]
H403  MOUNT-PAD-SQUARE3.2  [3,2-PAD-SQUARE]
H404  MOUNT-PAD-SQUARE3.2  [3,2-PAD-SQUARE]
J401  HDR_2X1282836-1282836-1  [W237-02]
J402  KK_PCFAN  [47053-1000]
L401  3.3uH  LL-3.3U-FERRITE-20%-12.5X12.5MM-10.5A  [DR127]
L402  22uH  LL-22U-FERRITE-20%-12.5X12.5MM-4A  [DR127]
LED402  LEDT1_3/4_RA  [LED_5MM_RA]
Q6  NPN_DARGLINGTONTIP122TO220BV  [TO220BV]
R55  590  RGEN0805_IPC  [0805_IPC-7351B]
R56  590  RGEN0805_IPC  [0805_IPC-7351B]
R57  590  RGEN0805_IPC  [0805_IPC-7351B]
R401  1.0  R90R-1.0-1%-AXIAL-3WP0817V  [P0817V]
R404  1.0  R90GEN1206_IPC  [1206_IPC-7351B]
R405  0.5  R90GEN1206_IPC  [1206_IPC-7351B]
R407  590  RGEN0805_IPC  [0805_IPC-7351B]
R408  10K  R90GEN0805_IPC  [0805_IPC-7351B]
U2  ADJ_ZENERTL431AILPRAGTO-92-LPRE  [TO-92-FORMED]
U401  LDO_3TERMMC78M12CTGTO220_VERT  [TO220BV]
U402  LDO_3TERMMC78M05CTGTO220_VERT  [TO220BV]
X6  HEATSINK_CLIPONATS-PCBT1085ATS-PCBT1085  [ATS-PCBT1085]
X7  HEATSINK_CLIPONATS-PCBT1085ATS-PCBT1085  [ATS-PCBT1085]
X402  HEATSINK_OMNI_DUALOMNI-UNI-30-75-D30-75-D  [OMNI-UNI-30-75-D]

### Nets
+5V: C407.1 C410.+ R407.1 R408.1 U402.3(OUT) ; also sheet 3,6
+12V: C406.1 C409.+ J402.2 U401.3(OUT) ; also sheet 3
+24V: C31.+ C403.1 C404.1 Q6.S(E) R57.1 U401.1(IN) U402.1(IN) ; also sheet 5
GND: C31.- C401.- C402.2 C403.2 C404.2 C405.2 C406.2 C407.2 C408.2 C409.- C410.- C411.2 C412.2 C413.2 D401.A(A1) H401.B3,2(MOUNT) H402.B3,2(MOUNT) H403.B3,2(MOUNT) H404.B3,2(MOUNT) J401.2 J402.1 LED402.K(C) R56.2 U2.2(A) U401.2(GND) U402.2(GND) X402.P1 X402.P2 ; also sheet 1,2,3,5,6
N$33: LED402.A R407.2
N$47: C405.1 L401.2 L402.1 R404.1 R405.1
N$51: J402.3 R408.2
N$91: C30.2 R56.1 R57.2 U2.1(R)
N$92: C30.1 Q6.G(B) R55.2 U2.3(C)
VB: C408.1 C411.1 C412.1 C413.1 L402.2 R404.2 R405.2 ; also sheet 1,5
VB_CONN: F401.1 J401.1
VB_FUSED: D401.K(C1) F401.2 R401.1
VB_ICL: C401.+ C402.1 L401.1 Q6.D(C) R55.1 R401.2
Unconnected: H1.B3,2(MOUNT) H2.B3,2(MOUNT) J402.4

### Notes on the sheet
- One stage LC filter
  First stage is L1 and C1
  Damping is with R and C2 in parallel with C1
  C2=4*C1
  f0=1/(w*pi*sqrt(L1*C1))
  Z0=R=sqrt(L1/C1))
  
  Two stage LC filter
  First stage is L1 and C1
  Second stage is L2 and C2
  Where L2=6*L1 and C2=4*C1
  And L2 is shunted by R=sqrt(L1/(4C1))=sqrt(L1/C2)
  f0=1/(w*pi*sqrt(6*L1*C1))=1/(w*pi*sqrt(L2*C1))
  Z0=sqrt(L1/C1)
- Input protection
  Intended for 48VDC supply
  Should work with 35-50VDC
- Damped LC filter
- To drain bias
- Heatsink
- Thermal pads and heatsink clips
- Connector for 12V fan
  Caution, limit current to 0.2A!
- Mounting holes
- Linear regulators
- Power Entry
- ! Caution !!
  Current design lacks advanced self-protection features!
  User is responsible for limiting unblanking duty cycle and bias voltage/current
  Current design is tested under following conditions:
  Supply voltage VB: 48V
  Bias current: 3.1A (in each FET)
  Max duty cycle: 3.5% (500us, 70Hz rep rate, passive convection)
  Max pulse width: 1ms

## Sheet 5 of 6
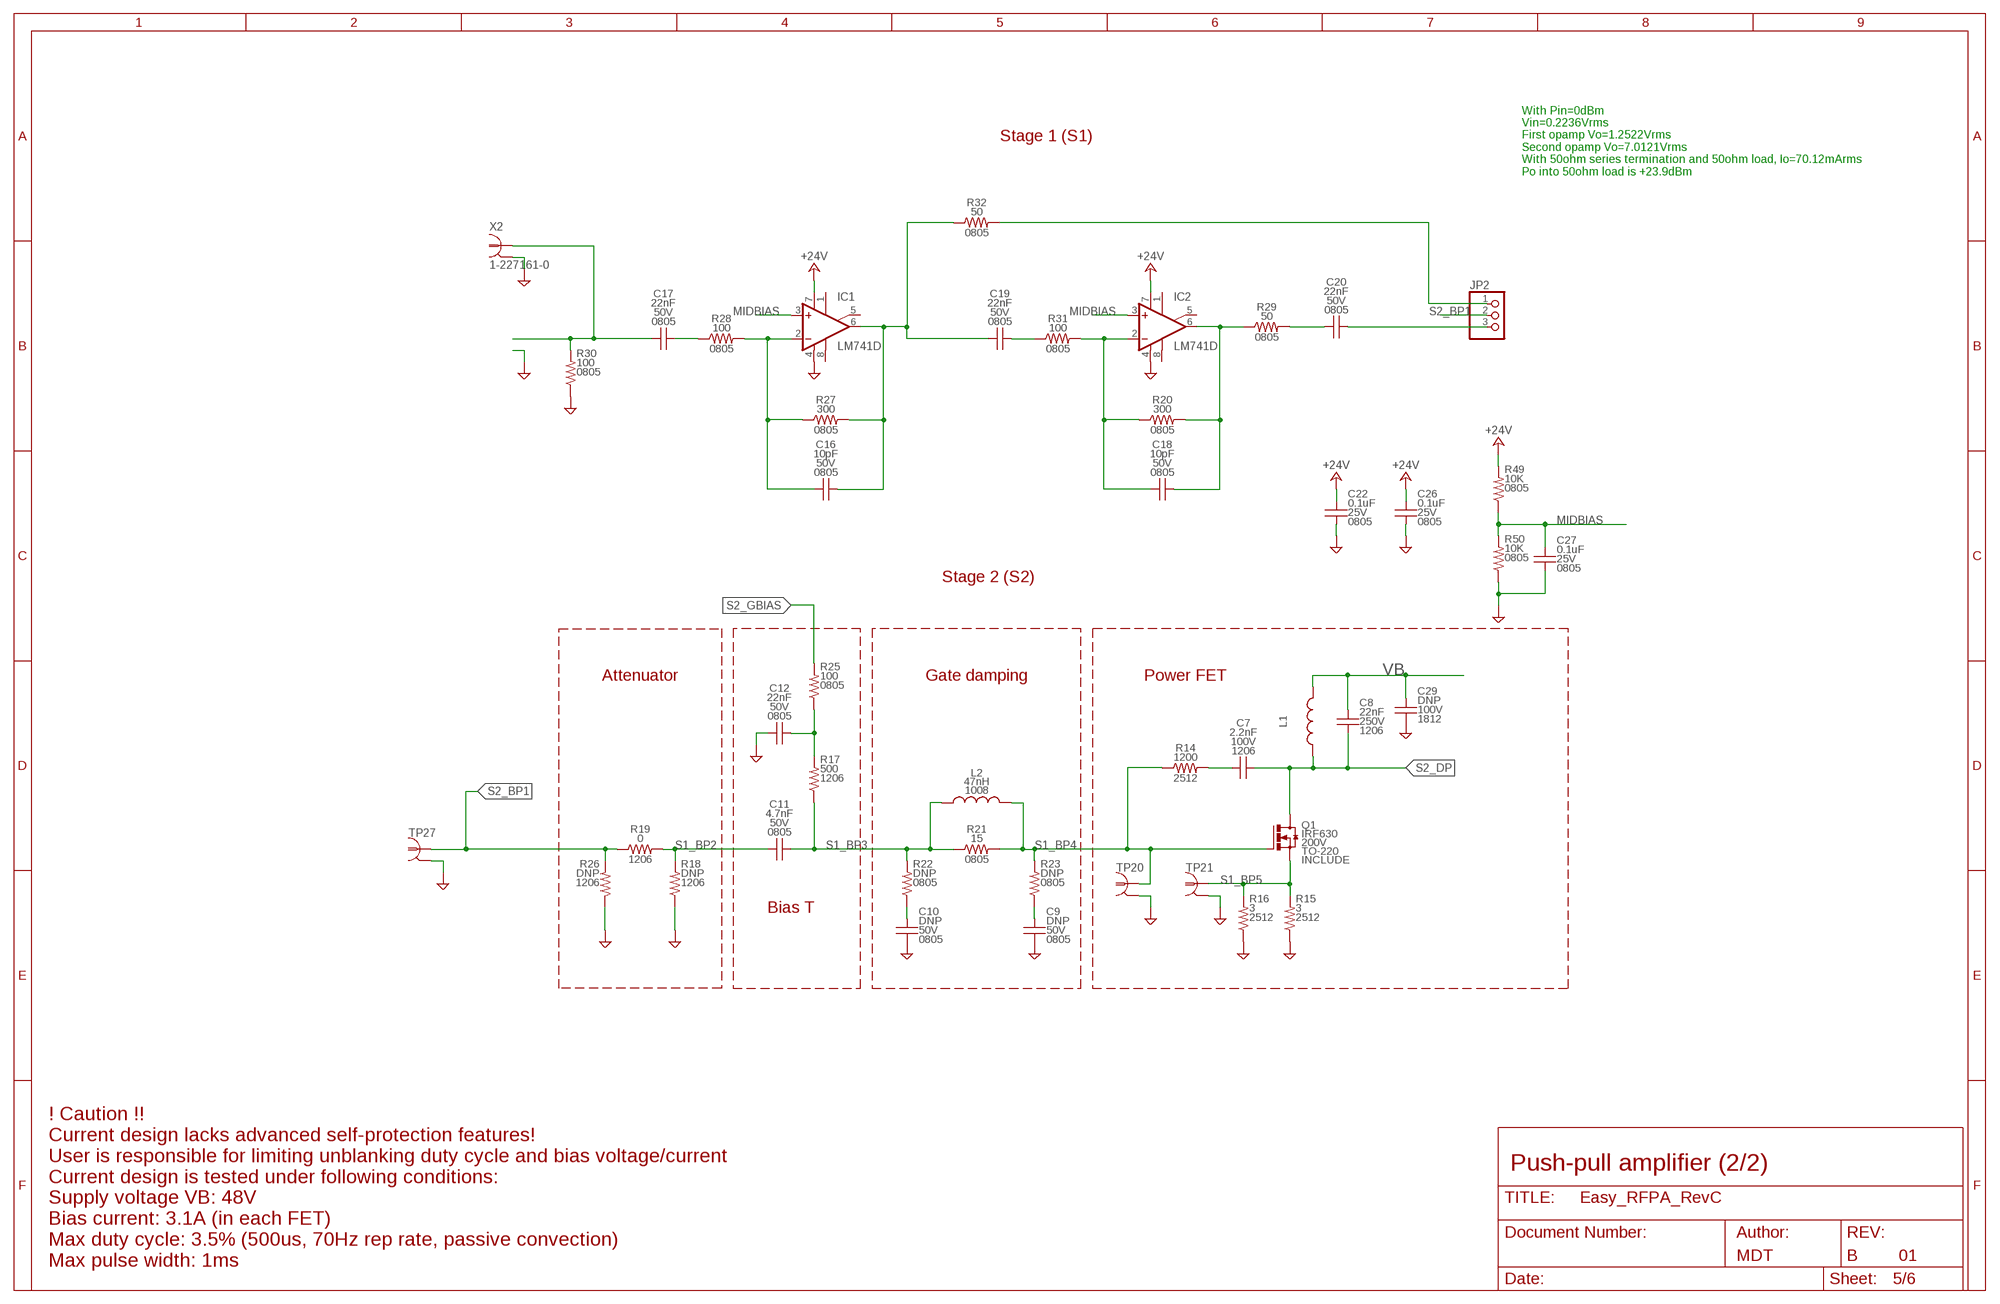
[diagram p4: schematic, sheet 5]

### Parts
C7  2.2nF  CGENC1206  [C1206]  (not fitted in variant IRF520N_20W)
C8  22nF  CC-22N-250V-5%-1206-NP0C1206  [C1206]
C9  DNP  CGEN0805_IPC  [0805_IPC-7351B]  (not fitted in variant IRF520N_20W)  (not fitted in variant IRF630_200W)
C10  DNP  CGEN0805_IPC  [0805_IPC-7351B]  (not fitted in variant IRF520N_20W)  (not fitted in variant IRF630_200W)
C11  4.7nF  CGEN0805_IPC  [0805_IPC-7351B]  (not fitted in variant IRF520N_20W)
C12  22nF  CGEN0805_IPC  [0805_IPC-7351B]  (not fitted in variant IRF520N_20W)
C16  10pF  CGEN0805_IPC  [0805_IPC-7351B]
C17  22nF  CGEN0805_IPC  [0805_IPC-7351B]
C18  10pF  CGEN0805_IPC  [0805_IPC-7351B]
C19  22nF  CGEN0805_IPC  [0805_IPC-7351B]
C20  22nF  CGEN0805_IPC  [0805_IPC-7351B]
C22  0.1uF  CGEN0805_IPC  [0805_IPC-7351B]
C26  0.1uF  CGEN0805_IPC  [0805_IPC-7351B]
C27  0.1uF  CGEN0805_IPC  [0805_IPC-7351B]
C29  DNP  CGENC1812  [C1812]
IC1  LM741D  [SO08]
IC2  LM741D  [SO08]
JP2  PINHD-1X3  [1X03]
L1  LDR74  [DR74]
L2  47nH  L_CHIPL-47N-AIR-5%-1008-1A1008  [L1008]  (not fitted in variant IRF520N_20W)
Q1  IRF630  MOSFET_NIRF630TO-220-VERT  [TO220BV]  (not fitted in variant IRF520N_20W)
R14  1200  R90GENR2512  [R2512]  (not fitted in variant IRF520N_20W)
R15  3  RGENR2512  [R2512]  (not fitted in variant IRF520N_20W)
R16  3  RGENR2512  [R2512]  (not fitted in variant IRF520N_20W)
R17  500  RGEN1206_IPC  [1206_IPC-7351B]  (not fitted in variant IRF520N_20W)
R18  DNP  RGEN1206_IPC  [1206_IPC-7351B]  (not fitted in variant IRF520N_20W)
R19  0  R90GEN1206_IPC  [1206_IPC-7351B]  (not fitted in variant IRF520N_20W)
R20  300  R90GEN0805_IPC  [0805_IPC-7351B]
R21  15  R90GEN0805_IPC  [0805_IPC-7351B]  (not fitted in variant IRF520N_20W)
R22  DNP  RGEN0805_IPC  [0805_IPC-7351B]  (not fitted in variant IRF520N_20W)  (not fitted in variant IRF630_200W)
R23  DNP  RGEN0805_IPC  [0805_IPC-7351B]  (not fitted in variant IRF520N_20W)  (not fitted in variant IRF630_200W)
R25  100  RGEN0805_IPC  [0805_IPC-7351B]  (not fitted in variant IRF520N_20W)
R26  DNP  RGEN1206_IPC  [1206_IPC-7351B]  (not fitted in variant IRF520N_20W)
R27  300  R90GEN0805_IPC  [0805_IPC-7351B]
R28  100  R90GEN0805_IPC  [0805_IPC-7351B]
R29  50  R90GEN0805_IPC  [0805_IPC-7351B]
R30  100  RGEN0805_IPC  [0805_IPC-7351B]
R31  100  R90GEN0805_IPC  [0805_IPC-7351B]
R32  50  R90GEN0805_IPC  [0805_IPC-7351B]
R49  10K  RGEN0805_IPC  [0805_IPC-7351B]
R50  10K  RGEN0805_IPC  [0805_IPC-7351B]
TP20  PROBE_TPTP_5MM  [PROBE_TP_5MM]
TP21  PROBE_TPTP_7P5MM  [PROBE_TP_7P5MM]
TP27  PROBE_TPTP_5MM  [PROBE_TP_5MM]
X2  1-227161-0  [AMP_227161]

### Nets
+24V: C22.1 C26.1 IC1.7(V+) IC2.7(V+) R49.1 ; also sheet 4
GND: C9.2 C10.2 C12.2 C22.2 C26.2 C27.2 C29.2 IC1.4(V-) IC2.4(V-) R15.2 R16.2 R18.2 R26.2 R30.2 R50.2 TP20.GND(GND1) TP21.GND(GND1) TP27.GND(GND1) X2.2 ; also sheet 1,2,3,4,6
MIDBIAS: C27.1 IC1.3(+IN) IC2.3(+IN) R49.2 R50.1
N$34: C16.2 IC1.2(-IN) R27.1 R28.2
N$41: C20.2 R29.2
N$57: C17.1 R28.1
N$60: C12.1 R17.1 R25.2
N$61: C10.1 R22.2
N$62: C9.1 R23.2
N$63: C7.1 R14.2
N$69: C17.2 R30.1 X2.1
N$70: C19.1 R31.1
N$71: C18.1 IC2.6(OUT) R20.2 R29.1
N$72: C18.2 IC2.2(-IN) R20.1 R31.2
N$73: C16.1 C19.2 IC1.6(OUT) R27.2 R32.1
N$74: C20.1 JP2.3
N$76: JP2.1 R32.2
S1_BP2: C11.2 R18.1 R19.2
S1_BP3: C11.1 L2.1 R17.2 R21.1 R22.1
S1_BP4: L2.2 Q1.G R14.1 R21.2 R23.1 TP20.TP
S1_BP5: Q1.S R15.1 R16.1 TP21.TP ; also sheet 3
S2_BP1: JP2.2 R19.1 R26.1 TP27.TP
S2_DP: C7.2 C8.2 L1.1 Q1.D ; also sheet 1
S2_GBIAS: R25.1 ; also sheet 3
VB: C8.1 C29.1 L1.2 ; also sheet 1,4
Unconnected: IC1.1(ON1) IC1.5(ON2) IC1.8(OPT) IC2.1(ON1) IC2.5(ON2) IC2.8(OPT)

### Notes on the sheet
- Stage 1 (S1)
- With Pin=0dBm
  Vin=0.2236Vrms
  First opamp Vo=1.2522Vrms
  Second opamp Vo=7.0121Vrms
  With 50ohm series termination and 50ohm load, Io=70.12mArms
  Po into 50ohm load is +23.9dBm
- Stage 2 (S2)
- Attenuator | Gate damping | Power FET
- Bias T
- Push-pull amplifier (2/2)
- ! Caution !!
  Current design lacks advanced self-protection features!
  User is responsible for limiting unblanking duty cycle and bias voltage/current
  Current design is tested under following conditions:
  Supply voltage VB: 48V
  Bias current: 3.1A (in each FET)
  Max duty cycle: 3.5% (500us, 70Hz rep rate, passive convection)
  Max pulse width: 1ms

## Sheet 6 of 6
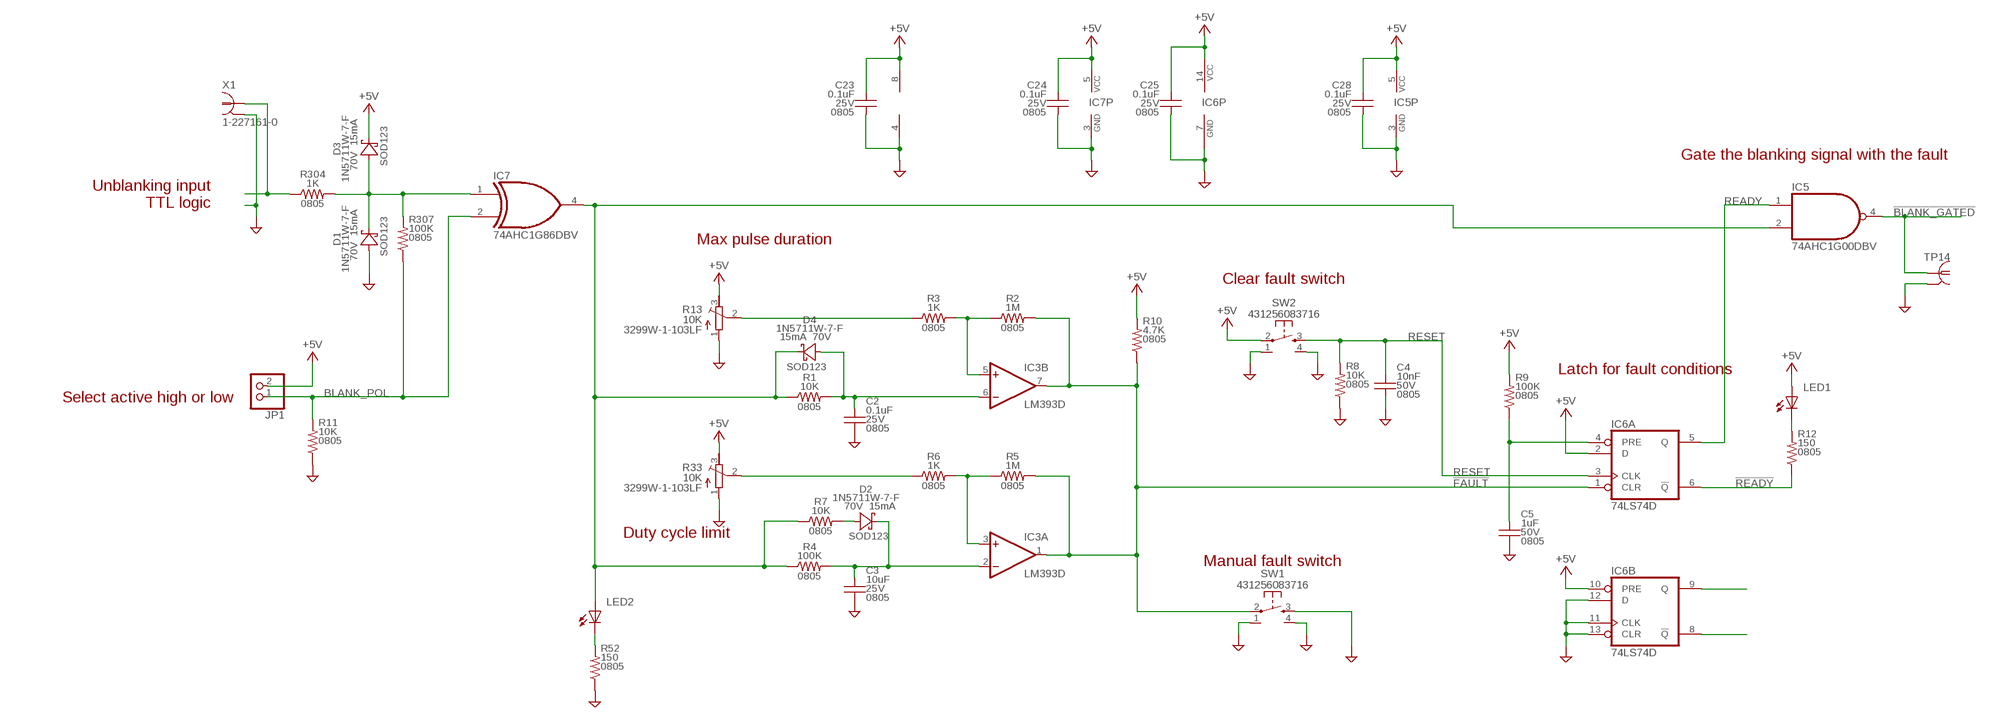
[diagram p5: schematic, sheet 6]

### Parts
C2  0.1uF  CGEN0805_IPC  [0805_IPC-7351B]
C3  10uF  CGEN0805_IPC  [0805_IPC-7351B]
C4  10nF  CGEN0805_IPC  [0805_IPC-7351B]
C5  1uF  CGEN0805_IPC  [0805_IPC-7351B]
C23  0.1uF  CGEN0805_IPC  [0805_IPC-7351B]
C24  0.1uF  CGEN0805_IPC  [0805_IPC-7351B]
C25  0.1uF  CGEN0805_IPC  [0805_IPC-7351B]
C28  0.1uF  CGEN0805_IPC  [0805_IPC-7351B]
D1  D-SCHOTTKY1N5711W-7-FSOD123  [SOD123]
D2  D-SCHOTTKY1N5711W-7-FSOD123  [SOD123]
D3  D-SCHOTTKY1N5711W-7-FSOD123  [SOD123]
D4  D-SCHOTTKY1N5711W-7-FSOD123  [SOD123]
IC3  LM393D  [SO08]
IC5  74AHC1G00DBV  [SOT23-5]
IC6  74LS74D  [SO14]
IC7  74AHC1G86DBV  [SOT23-5]
JP1  PINHD-1X2  [1X02]
LED1  LEDT1_3/4_RA  [LED_5MM_RA]
LED2  LEDT1_3/4_RA  [LED_5MM_RA]
R1  10K  R90GEN0805_IPC  [0805_IPC-7351B]
R2  1M  R90GEN0805_IPC  [0805_IPC-7351B]
R3  1K  R90GEN0805_IPC  [0805_IPC-7351B]
R4  100K  R90GEN0805_IPC  [0805_IPC-7351B]
R5  1M  R90GEN0805_IPC  [0805_IPC-7351B]
R6  1K  R90GEN0805_IPC  [0805_IPC-7351B]
R7  10K  R90GEN0805_IPC  [0805_IPC-7351B]
R8  10K  RGEN0805_IPC  [0805_IPC-7351B]
R9  100K  RGEN0805_IPC  [0805_IPC-7351B]
R10  4.7K  RGEN0805_IPC  [0805_IPC-7351B]
R11  10K  RGEN0805_IPC  [0805_IPC-7351B]
R12  150  RGEN0805_IPC  [0805_IPC-7351B]
R13  10K  RTRIMRTRIM-10K-10%-3299W-0.5W3299W  [RTRIM3299W]
R33  10K  RTRIMRTRIM-10K-10%-3299W-0.5W3299W  [RTRIM3299W]
R52  150  RGEN0805_IPC  [0805_IPC-7351B]
R304  1K  R90GEN0805_IPC  [0805_IPC-7351B]
R307  100K  RGEN0805_IPC  [0805_IPC-7351B]
SW1  SPST_NO_TACT_RA431256083716431256083716  [431256083716]
SW2  SPST_NO_TACT_RA431256083716431256083716  [431256083716]
TP14  PROBE_TPTP_5MM  [PROBE_TP_5MM]
X1  1-227161-0  [AMP_227161]

### Nets
!BLANK_GATED: IC5.4(O) TP14.TP ; also sheet 3
!FAULT: IC3.1(A:OUT) IC3.7(B:OUT) IC6.1(A:CLR) R2.2 R5.2 R10.2 SW1.2(P1)
!READY: IC6.6(A:!Q) R12.2
+5V: C23.1 C24.1 C25.1 C28.1 D3.K(C1) IC3.8(P:V+) IC5.5(VCC) IC6.2(A:D) IC6.10(B:PRE) IC6.14(P:VCC) IC7.5(VCC) JP1.2 LED1.A R9.1 R10.1 R13.3(E) R33.3(E) SW2.2(P1) ; also sheet 3,4
BLANK_POL: IC7.2(I1) JP1.1 R11.1 R307.2
GND: C2.2 C3.2 C4.2 C5.2 C23.2 C24.2 C25.2 C28.2 D1.A(A1) IC3.4(P:V-) IC5.3(GND) IC6.7(P:GND) IC6.11(B:CLK) IC6.12(B:D) IC6.13(B:CLR) IC7.3(GND) R8.2 R11.2 R13.1(A) R33.1(A) R52.2 SW1.1(G1) SW1.3(S1) SW1.4(G2) SW2.1(G1) SW2.4(G2) TP14.GND(GND1) X1.2 ; also sheet 1,2,3,4,5
N$3: D1.K(C1) D3.A(A1) IC7.1(I0) R304.2 R307.1
N$27: IC6.9(B:Q)
N$37: IC6.8(B:!Q)
N$53: R304.1 X1.1
N$54: C2.1 D4.A(A1) IC3.6(B:-IN) R1.2
N$55: C5.1 IC6.4(A:PRE) R9.2
N$56: IC3.5(B:+IN) R2.1 R3.2
N$59: R3.1 R13.2(S)
N$65: C3.1 D2.K(C1) IC3.2(A:-IN) R4.2
N$67: IC3.3(A:+IN) R5.1 R6.2
N$68: R6.1 R33.2(S)
N$77: D4.K(C1) IC5.2(I1) IC7.4(O) LED2.A R1.1 R4.1 R7.1
N$78: D2.A(A1) R7.2
N$80: LED2.K(C) R52.1
N$81: LED1.K(C) R12.1
READY: IC5.1(I0) IC6.5(A:Q)
RESET: C4.1 IC6.3(A:CLK) R8.1 SW2.3(S1)

### Notes on the sheet
- Gate the blanking signal with the fault
- Unblanking input
  TTL logic
- Max pulse duration
- Clear fault switch
- Latch for fault conditions
- Select active high or low
- Duty cycle limit
- Manual fault switch

## Library data of the parts
C1 C4 C5 C11-C13 C16-C20 C30 C104-C107 C201-C204 C304 = MDT_C:C; BOM: INCLUDE; PACKAGE: 0805; VOLTAGE: 50V
C2 C3 C6 C21-C28 C301 C305 = MDT_C:C; BOM: INCLUDE; PACKAGE: 0805; VOLTAGE: 25V
C7 C112 C113 C209 C210 = MDT_C:C; BOM: INCLUDE; PACKAGE: 1206; VOLTAGE: 100V
C8 = MDT_C:C; BOM: EXCLUDE; DIALECTRIC: NP0; PACKAGE: 1206; PARTNO: C3216NP02E223J160AA; TOL: 5; VOLTAGE: 250V
C9 C10 C108-C111 C205-C208 = MDT_C:C; BOM: EXCLUDE; PACKAGE: 0805; VOLTAGE: 50V
C14 C15 C302 C303 = MDT_C:C; BOM: EXCLUDE; PACKAGE: 0805; VOLTAGE: 25V
C29 C116 C117 = MDT_C:C; BOM: EXCLUDE; PACKAGE: 1812; VOLTAGE: 100V
C31 C409 C410 = MDT_C:CPOL; BOM: INCLUDE; DIALECTRIC: ELEC; PARTNO: 860010773010; SIZE: 6.3DX12.5L; TOL: +/-20%; VENDOR: Wurth; VOLTAGE: 63V
C118 = MDT_C:C; BOM: EXCLUDE; PACKAGE: 1812; VOLTAGE: 250V
C401 = MDT_C:CPOL; BOM: INCLUDE; DIALECTRIC: ELEC; PARTNO: MAL225638332E3; SIZE: 25DX37L; TOL: +/-20%; VENDOR: Vishay; VOLTAGE: 63V
C402 C405 C408 C411-C413 = MDT_C:C; BOM: INCLUDE; DIALECTRIC: X7S; PACKAGE: 2220; PARTNO: CGA9N3X7S2A106M230KE; TOL: 20%; VOLTAGE: 100V
C403 C404 = MDT_C:C; BOM: INCLUDE; DIALECTRIC: X7S; PACKAGE: 1210; VOLTAGE: 50V
C406 C407 = MDT_C:C; BOM: INCLUDE; DIALECTRIC: X7R; PACKAGE: 1206; VOLTAGE: 50V
D1-D4 = MDT_Diode:D-SCHOTTKY; BOM: INCLUDE; CURRENT: 15mA; DEVICE: 1N5711W-7-F; PACKAGE: SOD123; PARTNO: 1N5711W-7-F; VOLTAGE: 70V
D401 = MDT_Diode:D-SCHOTTKY; BOM: INCLUDE; CURRENT: 8A; DEVICE: SK810L-TP; PACKAGE: SMC; PARTNO: SK810L-TP; VENDOR: Micro Commercial; VOLTAGE: 100V
F401 = MDT_FUSE:FUSE_2P; BOM: INCLUDE; DESCRIPTION: FUSE BLOK CARTRIDGE 400V 10A PCB; PARTNO: 02540121Z; VENDOR: Littelfuse
H1 H2 H401-H404 = holes:MOUNT-PAD-SQUARE: MOUNTING PAD, square; BOM: EXCLUDE
IC1 IC2 = linear:*741: OP AMP
IC3 = linear:LM393: COMPARATOR
IC5 = 74xx-little-us:74*1G00: 2-input NAND gate
IC6 = 74xx-us:74*74: Dual D type positive edge triggered FLIP FLOP, preset and clear
IC7 = 74xx-little-us:74*1G86: 2-input EXCLUSIV-OR gate
J401 = MDT_CON:HDR_2X1; BOM: INCLUDE; DESCRIPTION: TERM BLK 2POS SIDE ENTRY 5MM PCB; PARTNO: 282836-1; PINS: 2x1; VENDOR: TE
J402 = MDT_CON:KK_PCFAN; BOM: INCLUDE; DESCRIPTION: CONN HEADER VERT 4POS 2.54MM; PARTNO: 47053-1000; VENDOR: MOLEX
JP1 JP301 JP302 = pinhead:PINHD-1X2: PIN HEADER
JP2 = pinhead:PINHD-1X3: PIN HEADER
L1 = MDT_L:L
L2 L101 L102 L201 L202 = MDT_L:L_CHIP; BOM: INCLUDE; CORE: AIR; DCR: 0.16; IDC: 1A; PACKAGE: 1008; PARTNO: 1008CS-470XJLC; TOL: 5%
L103 L104 L401 = MDT_L:L; BOM: INCLUDE; CURRENT: 10.5A; DEVICE: DR127-3R3-R; ESR: 5.67m; PARTNO: DR127-3R3-R; TOL: 20%
L402 = MDT_L:L; BOM: INCLUDE; CURRENT: 4.0A; DEVICE: DR127-220-R; ESR: 39.1m; PARTNO: DR127-220-R; TOL: 20%
LED1 LED2 LED402 = MDT_Diode:LED
Q1 Q101 Q102 Q201 Q202 = MDT_TRANS:MOSFET_N; BOM: INCLUDE; CURRENT: 9A; DESCRIPTION: MOSFET N-CH 200V 9A TO220AB; DEVICE: IRF630; PACKAGE: TO-220; PARTNO: IRF630; VENDOR: STM; VOLTAGE: 200V
Q2 Q301 = MDT_TRANS:MOSFET_N; BOM: INCLUDE; CURRENT: 0.17A; DESCRIPTION: MOSFET N-CH 100V 170MA SOT23-3; DEVICE: BSS123; PACKAGE: SOT23-3; PARTNO: BSS123-7-F; VENDOR: Diodes Inc; VOLTAGE: 100V
Q3 Q303 = MDT_TRANS:NPN; BOM: INCLUDE; CURRENT: 0.2A; DESCRIPTION: TRANS NPN 40V 200MA TO236AB; DEVICE: MMBT3904; PACKAGE: SOT23-3; PARTNO: MMBT3904,215; VENDOR: Nexperia; VOLTAGE: 40V
Q4 Q302 = MDT_TRANS:PNP; BOM: INCLUDE; CURRENT: 0.2A; DESCRIPTION: TRANS PNP 40V 200MA TO236AB; DEVICE: MMBT3906; PACKAGE: SOT23-3; PARTNO: PMBT3906,215; VENDOR: Nexperia; VOLTAGE: 40V
Q6 = MDT_TRANS:NPN_DARGLINGTON; BOM: INCLUDE; CURRENT: 5A; DESCRIPTION: TRANS NPN DARL 100V 5A TO220; DEVICE: TIP122; PACKAGE: TO-220-VERT; PARTNO: TIP122G; VENDOR: ONSEMI; VOLTAGE: 100V
R1-R7 R20 R21 R27-R29 R31 R32 R35-R39 R43 R114 R115 R213 R214 R302-R306 R308 R310 R312 R315-R317 R408 = MDT_R:R90; BOM: INCLUDE; PACKAGE: 0805
R8-R12 R25 R30 R41 R49 R50 R52 R55-R57 R101 R108 R110 R132 R207 R209 R307 R314 R407 = MDT_R:R; BOM: INCLUDE; PACKAGE: 0805
R13 R33 R34 R301 = MDT_R:RTRIM; BOM: INCLUDE; DESCRIPTION: TRIMMER 10K OHM 0.5W PC PIN TOP; PARTNO: 3299W-1-103LF; POWER: 0.5W; TOL: 10%; VENDOR: Bourns
R14 R118-R121 R217-R220 = MDT_R:R90; BOM: INCLUDE; PACKAGE: 2512
R15 R16 R122-R129 R221-R228 = MDT_R:R; BOM: INCLUDE; PACKAGE: 2512
R17 R18 R26 R102 R103 R106 R107 R109 R111 R201 R202 R205 R206 R208 R210 = MDT_R:R; BOM: INCLUDE; PACKAGE: 1206
R19 R54 R104 R105 R203 R204 R404 R405 = MDT_R:R90; BOM: INCLUDE; PACKAGE: 1206
R22 R23 R42 R112 R113 R116 R117 R211 R212 R215 R216 R311 = MDT_R:R; BOM: EXCLUDE; PACKAGE: 0805
R24 R53 = MDT_R:R90; BOM: EXCLUDE; PACKAGE: 1206
R40 R44-R48 R51 R313 = MDT_R:R90; BOM: EXCLUDE; PACKAGE: 0805
R401 = MDT_R:R90; BOM: INCLUDE; PACKAGE: AXIAL; PARTNO: PAC300001008FAC000; POWER: 3W; TOL: 1%; VENDOR: Vishay
SW1 SW2 = MDT_SWITCH:SPST_NO_TACT_RA; BOM: INCLUDE; CIRCUIT: SPST-NO; CURRENT: 0.05A; PARTNO: 431256083716; VENDOR: WURTH
T1 = MDT_TRAFO:HP1_TRAFO; BOM: INCLUDE; CURRENT: 0.74; ISAT: NOGAP; PARTNO: HP1-1400LB; RATIO: 1:1:1:1:1:1; VENDOR: COILCRAFT
T102 = MDT_TRAFO:HP4_TRAFO; BOM: INCLUDE; CURRENT: 1.88A; ISAT: 1A; PARTNO: HP4-0140LB; RATIO: 1:1:1:1:1:1; VENDOR: COILCRAFT
TP1 TP3 TP7 TP9 TP11-TP14 TP18-TP20 TP22 TP23 TP25 TP27 = MDT_CON:PROBE_TP; BOM: EXCLUDE; DESCRIPTION: Probe testpoint 5mm
TP2 TP4-TP6 TP8 TP10 TP21 = MDT_CON:PROBE_TP; BOM: EXCLUDE; DESCRIPTION: Probe testpoint 7.5mm
U1 U302 = MDT_IC:OPAMP_QUAD; BOM: INCLUDE; DESCRIPTION: IC OPAMP GP 4 CIRCUIT 14SOIC; PARTNO: TLV274ID; VENDOR: Texas Instruments
U2 = MDT_VREF:ADJ_ZENER; BOM: INCLUDE; CURRENT: 1-100mA; DESCRIPTION: IC VREF SHUNT ADJ 1% TO92-3; PACKAGE: TO-92-3; PARTNO: TL431AILPRAG; TOL: 1%; VENDOR: ONSEMI; VOLTAGE: 2.5-36V
U401 = MDT_IC:LDO_3TERM; BOM: INCLUDE; DESCRIPTION: IC REG LINEAR 12V 500MA TO220AB; PACKAGE: TO220; PARTNO: MC78M12CTG; VENDOR: ONSEMI
U402 = MDT_IC:LDO_3TERM; BOM: INCLUDE; DESCRIPTION: IC REG LINEAR 5V 500MA TO220AB; PACKAGE: TO220; PARTNO: MC78M05CTG; VENDOR: ONSEMI
X1 X2 X4 = con-coax:?227161*: JACK, RIGHT ANGLE, 50 OHM, PCB, BNC Source: amp_227161.pdf; MF: TYCO ELECTRONICS; MPN: 1-227161; OC_FARNELL: unknown; OC_NEWARK: 33B3200
X6 X7 = MDT_HEATSINK:HEATSINK_CLIPON; BOM: INCLUDE; DESCRIPTION: HEATSINK TO-220 CLIP-ON; PARTNO: ATS-PCBT1085; VENDOR: ATS
X402 = MDT_HEATSINK:HEATSINK_OMNI_DUAL; BOM: INCLUDE; DESCRIPTION: HEATSINK TO-247 TO-264 TO-220; PARTNO: OMNI-UNI-30-75-D; VENDOR: Wakefield-Vette

## Net classes
1 32W_20S: width 0.813 mm, drill 0.6 mm, clearance 0.508 mm
2 32W_30S: width 0.813 mm, drill 0.6 mm, clearance 0.762 mm
3 50W_30S: width 1.27 mm, drill 0.6 mm, clearance 0.762 mm